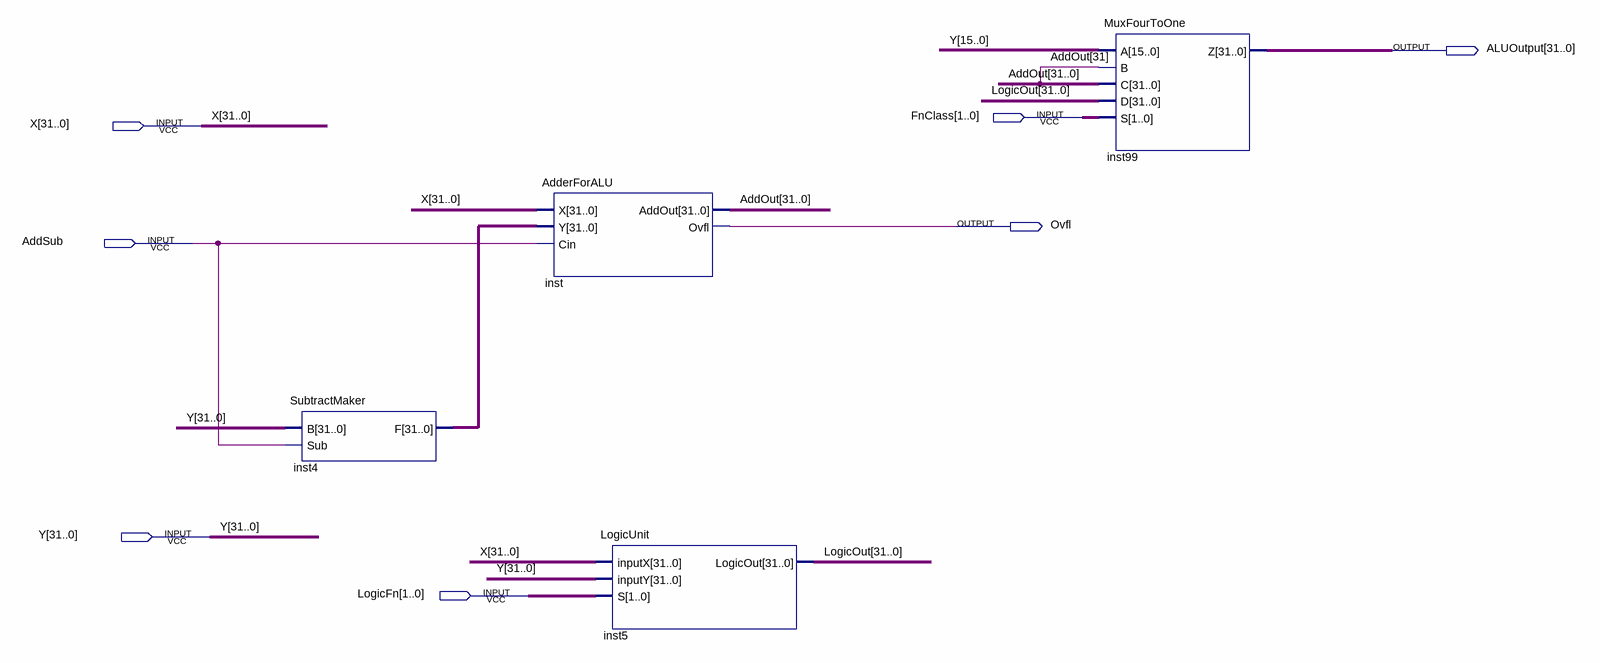
[diagram p0: schematic sheet]
// Quartus schematic Lab03ALU.bdf as structural Verilog: 4 symbols, 7 pins
module Lab03ALU (
  input  [1:0] FnClass,
  input  [31:0] X,
  input  AddSub,
  input  [31:0] Y,
  input  [1:0] LogicFn,
  output [31:0] ALUOutput,
  output Ovfl
);

  wire [31:0] AddOut, inst4_f, LogicOut;

  SubtractMaker inst4 (.B(Y), .Sub(AddSub), .F(inst4_f));
  AdderForALU inst (.X(X), .Y(inst4_f), .Cin(AddSub), .AddOut(AddOut), .Ovfl(Ovfl));
  LogicUnit inst5 (.inputX(X), .inputY(Y), .S(LogicFn), .LogicOut(LogicOut));
  MuxFourToOne inst99 (.A(Y[15:0]), .B(AddOut[31]), .C(AddOut), .D(LogicOut), .S(FnClass), .Z(ALUOutput));
endmodule
